# Altium schematic sheet Sheet1.SchDoc
size A4; Date: 20.05.2024; SheetNumber: 1; SheetTotal: 1
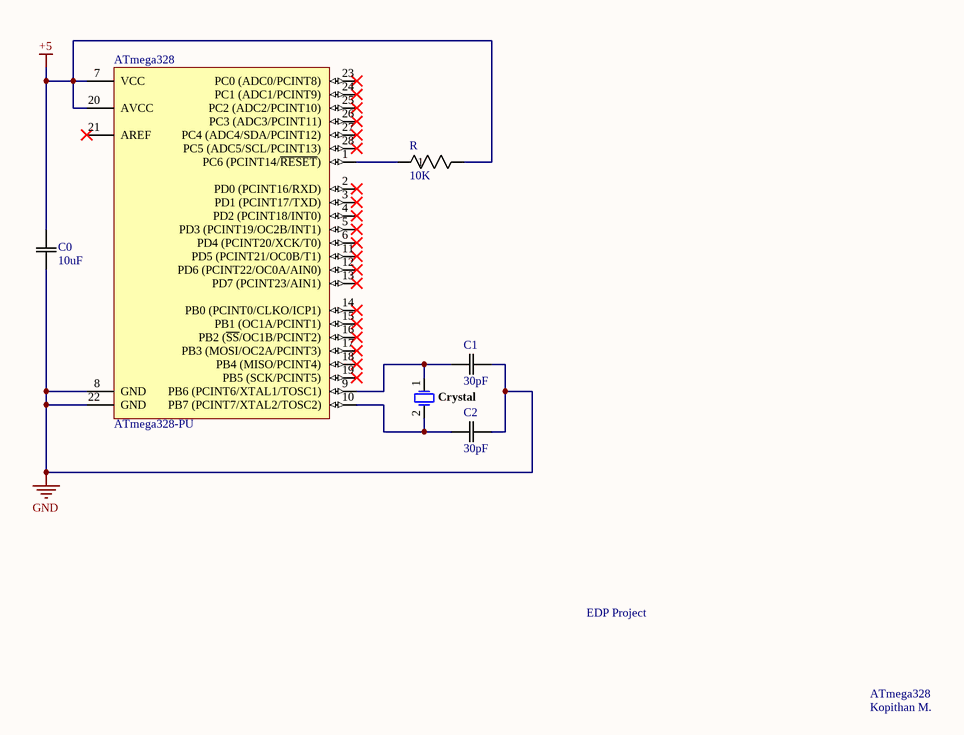
[diagram p0: Sheet1.SchDoc]

## Parts
ATmega328  ATmega328-PU  [28P3]
C0  10uF  [CAP_WCAP-PTHR_6P3X8P0_WRE]
C1  30pF  [CAP_CD15_CND]
C2  30pF  [CAP_CD15_CND]
Crystal  FOXSLF/160-20  [FOX-FOXSLF160-20]  (value not drawn)
R  10K  [RES_TYCO_YR1_TYC]

## Nets
+5: ATmega328.7(VCC) ATmega328.20(AVCC) C0.2 R.2
GND: ATmega328.8(GND) ATmega328.22(GND) C0.1 C1.2 C2.2
NetATmega328_1: ATmega328.1(PC6_(PCINT14/~{RESET})) R.1
NetATmega328_9: ATmega328.9(PB6_(PCINT6/XTAL1/TOSC1)) C1.1 Crystal.1
NetATmega328_10: ATmega328.10(PB7_(PCINT7/XTAL2/TOSC2)) C2.1 Crystal.2

Not connected (* = marked no-connect by the designer): ATmega328 2(PD0_(PCINT16/RXD))* 3(PD1_(PCINT17/TXD))* 4(PD2_(PCINT18/INT0))* 5(PD3_(PCINT19/OC2B/INT1))* 6(PD4_(PCINT20/XCK/T0))* 11(PD5_(PCINT21/OC0B/T1))* 12(PD6_(PCINT22/OC0A/AIN0))* 13(PD7_(PCINT23/AIN1))* 14(PB0_(PCINT0/CLKO/ICP1))* 15(PB1_(OC1A/PCINT1))* 16(PB2_(~{SS}/OC1B/PCINT2))* 17(PB3_(MOSI/OC2A/PCINT3))* 18(PB4_(MISO/PCINT4))* 19(PB5_(SCK/PCINT5))* 21(AREF)* 23(PC0_(ADC0/PCINT8))* 24(PC1_(ADC1/PCINT9))* 25(PC2_(ADC2/PCINT10))* 26(PC3_(ADC3/PCINT11))* 27(PC4_(ADC4/SDA/PCINT12))* 28(PC5_(ADC5/SCL/PCINT13))*

## Notes on the sheet
- EDP Project
- ATmega328
- Kopithan M.

## Library data of the parts
ATmega328 = CMP-0095-00015-2: 8-bit AVR Microcontroller, 32KB Flash, 1KB EEPROM, 2KB SRAM, 28-pin PDIP, Industrial Grade (-40°C to 85°C); ComponentLink3Description: ATmega48A/48PA/88A/88PA/168A/168PA/328/328P Summary; RevisionNote: DatasheetVersion updated. URLs added.; DatasheetVersion: revD, May-2011; ComponentLink1URL: http://www.atmel.com/; PackageVersion: revB, Sep-2001; PackageDescription: 28-lead (0.300"/7.62mm Wide) Plastic Dual Inline Package (PDIP); PackageReference: 28P3; ComponentLink1Description: Manufacturer URL; ComponentLink2Description: ATmega48A/48PA/88A/88PA/168A/168PA/328/328P Datasheet; ComponentLink3URL: http://www.atmel.com/dyn/resources/prod_documents/8271S.pdf; ComponentLink2URL: http://www.atmel.com/dyn/resources/prod_documents/8271.pdf
C0 = 870055673001: Mfr_Name: Wurth Electronics
C1 C2 = CD15ED300JO3F: Mfr_Name: Cornell Dubilier; Type: Mica and PTFE Capacitors
Crystal = CMP-1749-00003-1: Resistance Weld Thru-Hole Crystal, 16 MHz, -20 to 70 degC, 2-Pin THD, RoHS, Bulk; Voltage Rating: 250 V; Tolerance: 1%; Resistance: 221 kohm; Case\Package: Axial; Power Rating: 250 mW; RoHSCompliant: true; Package Quantity: 200; Packaging: Bulk; Min Operating Temperature: -55 degC; DatasheetVersion: Mar-15; ComponentLink1URL: http://www.foxonline.com/; Max Operating Temperature: 155 degC; PackageReference: FOXSLF160-20; Mount: Through Hole; PackageDescription: 2-Pin Through Hole Device, Body 11.35 x 4.65 mm; ComponentLink1Description: Manufacturer URL; ComponentLink2URL: http://www.foxonline.com/pdfs/hc49slf.pdf; ComponentLink2Description: Datasheet; Length: 0.248 inch
R = YR1B10KCC: 30pF; Mfr_Name: TE Connectivity